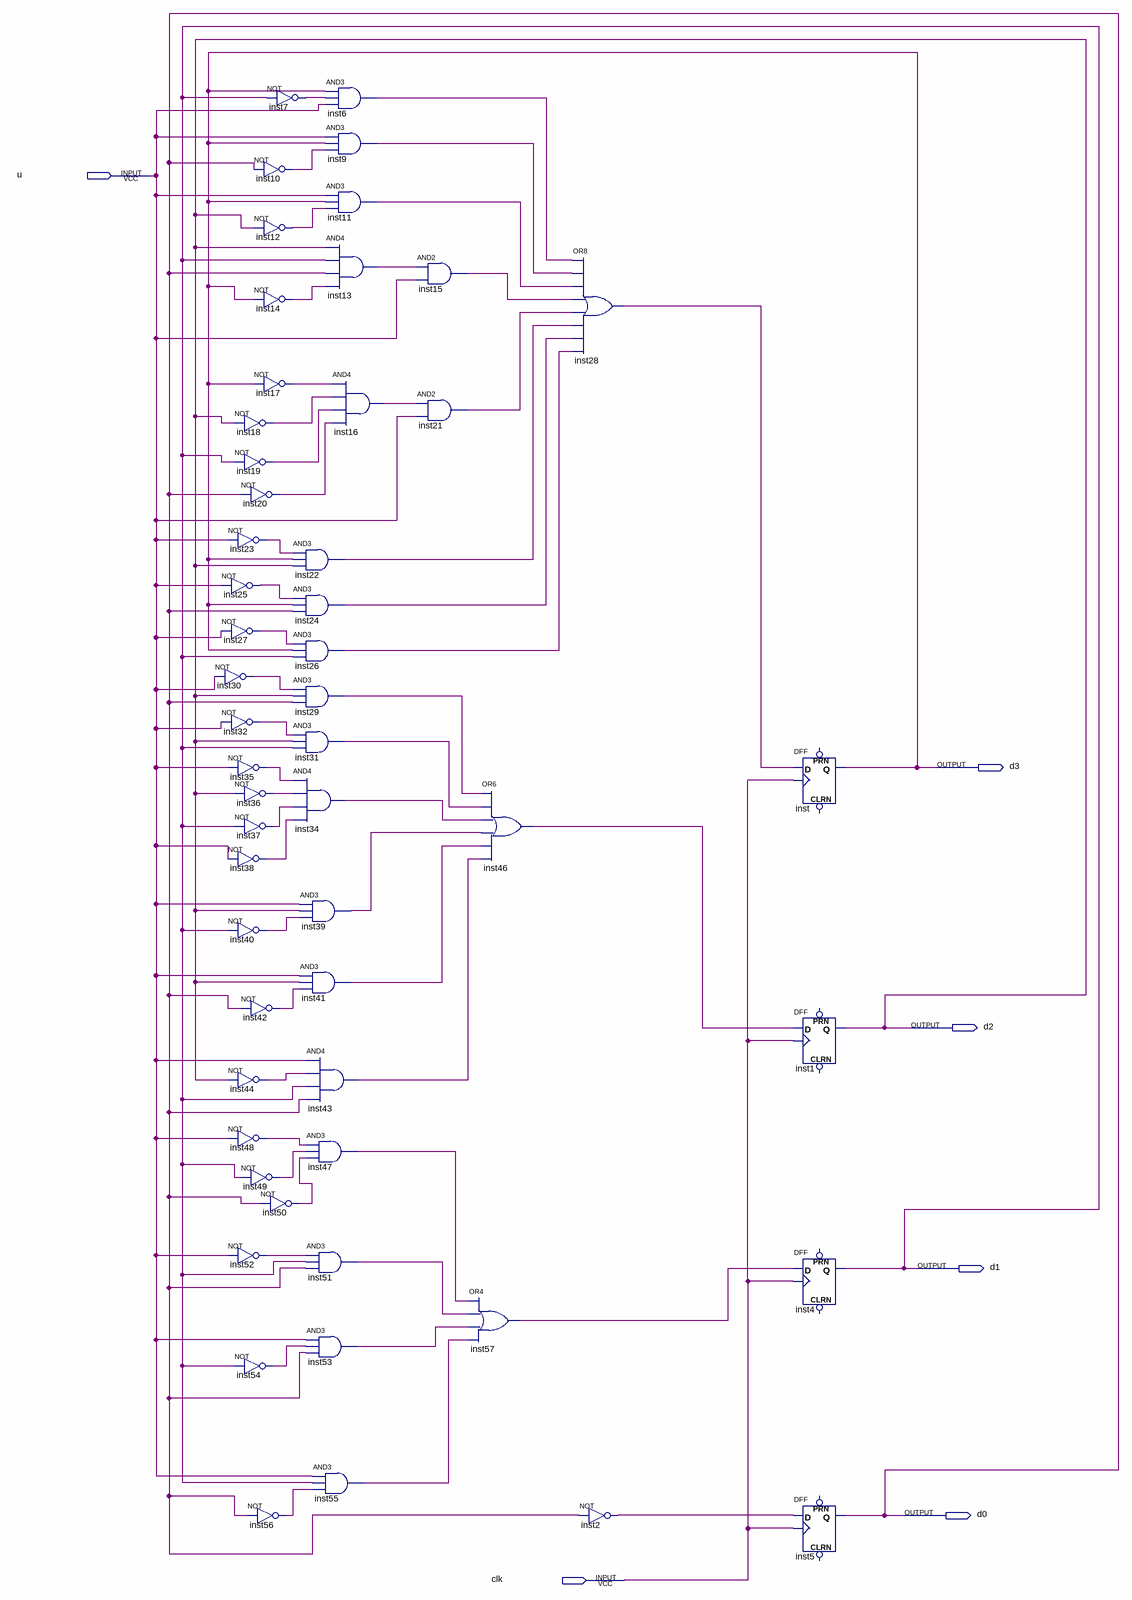
[diagram p0: schematic sheet]
// Quartus schematic 4bitCounter.bdf as structural Verilog: 54 symbols, 6 pins
module \4bitCounter  (
  input  u,
  input  clk,
  output d3,
  output d2,
  output d1,
  output d0
);

  wire inst2_out, inst6_out, inst7_out, inst9_out, inst10_out, inst11_out, inst12_out, inst13_out,
       inst14_out, inst15_out, inst16_out, inst17_out, inst18_out, inst19_out, inst20_out, inst21_out,
       inst22_out, inst23_out, inst24_out, inst25_out, inst26_out, inst27_out, inst28_out, inst29_out,
       inst30_out, inst31_out, inst32_out, inst34_out, inst35_out, inst36_out, inst37_out, inst38_out,
       inst39_out, inst40_out, inst41_out, inst42_out, inst43_out, inst44_out, inst46_out, inst47_out,
       inst48_out, inst49_out, inst50_out, inst51_out, inst52_out, inst53_out, inst54_out, inst55_out,
       inst56_out, inst57_out;

  not inst18 (inst18_out, d2);
  not inst19 (inst19_out, d1);
  not inst23 (inst23_out, u);
  not inst25 (inst25_out, u);
  not inst27 (inst27_out, u);
  not inst30 (inst30_out, u);
  not inst32 (inst32_out, u);
  not inst35 (inst35_out, u);
  not inst36 (inst36_out, d2);
  not inst37 (inst37_out, d1);
  not inst38 (inst38_out, u);
  not inst40 (inst40_out, d1);
  not inst44 (inst44_out, d2);
  not inst48 (inst48_out, u);
  not inst52 (inst52_out, u);
  not inst54 (inst54_out, d1);
  not inst7 (inst7_out, d1);
  not inst10 (inst10_out, d0);
  not inst12 (inst12_out, d2);
  not inst14 (inst14_out, d3);
  not inst17 (inst17_out, d3);
  not inst20 (inst20_out, d0);
  not inst42 (inst42_out, d0);
  not inst49 (inst49_out, d1);
  not inst50 (inst50_out, d0);
  not inst56 (inst56_out, d0);
  and inst6 (inst6_out, d3, inst7_out, u);
  and inst9 (inst9_out, u, d3, inst10_out);
  and inst11 (inst11_out, u, d3, inst12_out);
  and inst13 (inst13_out, d2, d1, d0, inst14_out);
  and inst16 (inst16_out, inst17_out, inst18_out, inst19_out, inst20_out);
  and inst22 (inst22_out, inst23_out, d3, d2);
  and inst24 (inst24_out, inst25_out, d3, d0);
  and inst26 (inst26_out, inst27_out, d3, d1);
  and inst29 (inst29_out, inst30_out, d2, d0);
  and inst31 (inst31_out, inst32_out, d2, d1);
  and inst34 (inst34_out, inst35_out, inst36_out, inst37_out, inst38_out);
  and inst39 (inst39_out, u, d2, inst40_out);
  and inst41 (inst41_out, u, d2, inst42_out);
  and inst43 (inst43_out, u, inst44_out, d1, d0);
  and inst47 (inst47_out, inst48_out, inst49_out, inst50_out);
  and inst51 (inst51_out, inst52_out, d1, d0);
  and inst53 (inst53_out, u, inst54_out, d0);
  and inst55 (inst55_out, u, d1, inst56_out);
  and inst15 (inst15_out, inst13_out, u);
  and inst21 (inst21_out, inst16_out, u);
  or inst46 (inst46_out, inst29_out, inst31_out, inst34_out, inst39_out, inst41_out, inst43_out);
  or inst57 (inst57_out, inst47_out, inst51_out, inst53_out, inst55_out);
  or inst28 (inst28_out, inst6_out, inst9_out, inst11_out, inst15_out, inst21_out, inst22_out, inst24_out, inst26_out);
  not inst2 (inst2_out, d0);
  DFF inst (.CLK(clk), .D(inst28_out), .Q(d3));  // open: CLRN, PRN
  DFF inst1 (.CLK(clk), .D(inst46_out), .Q(d2));  // open: CLRN, PRN
  DFF inst4 (.CLK(clk), .D(inst57_out), .Q(d1));  // open: CLRN, PRN
  DFF inst5 (.CLK(clk), .D(inst2_out), .Q(d0));  // open: CLRN, PRN
endmodule
